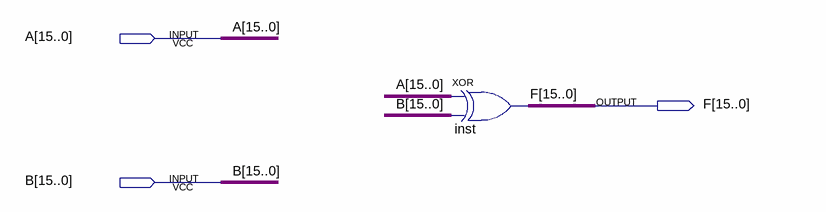
[diagram p0: schematic sheet]
// Quartus schematic SixteenBitXor.bdf as structural Verilog: 1 symbols, 3 pins
module SixteenBitXor (
  input  [15:0] A,
  input  [15:0] B,
  output [15:0] F
);

  assign F = A ^ B;  // XOR inst, 16 bits wide
endmodule
